# Altium schematic sheet Bite_Force_System_Schematic.SchDoc
size A3; SheetNumber: 1; SheetTotal: 1
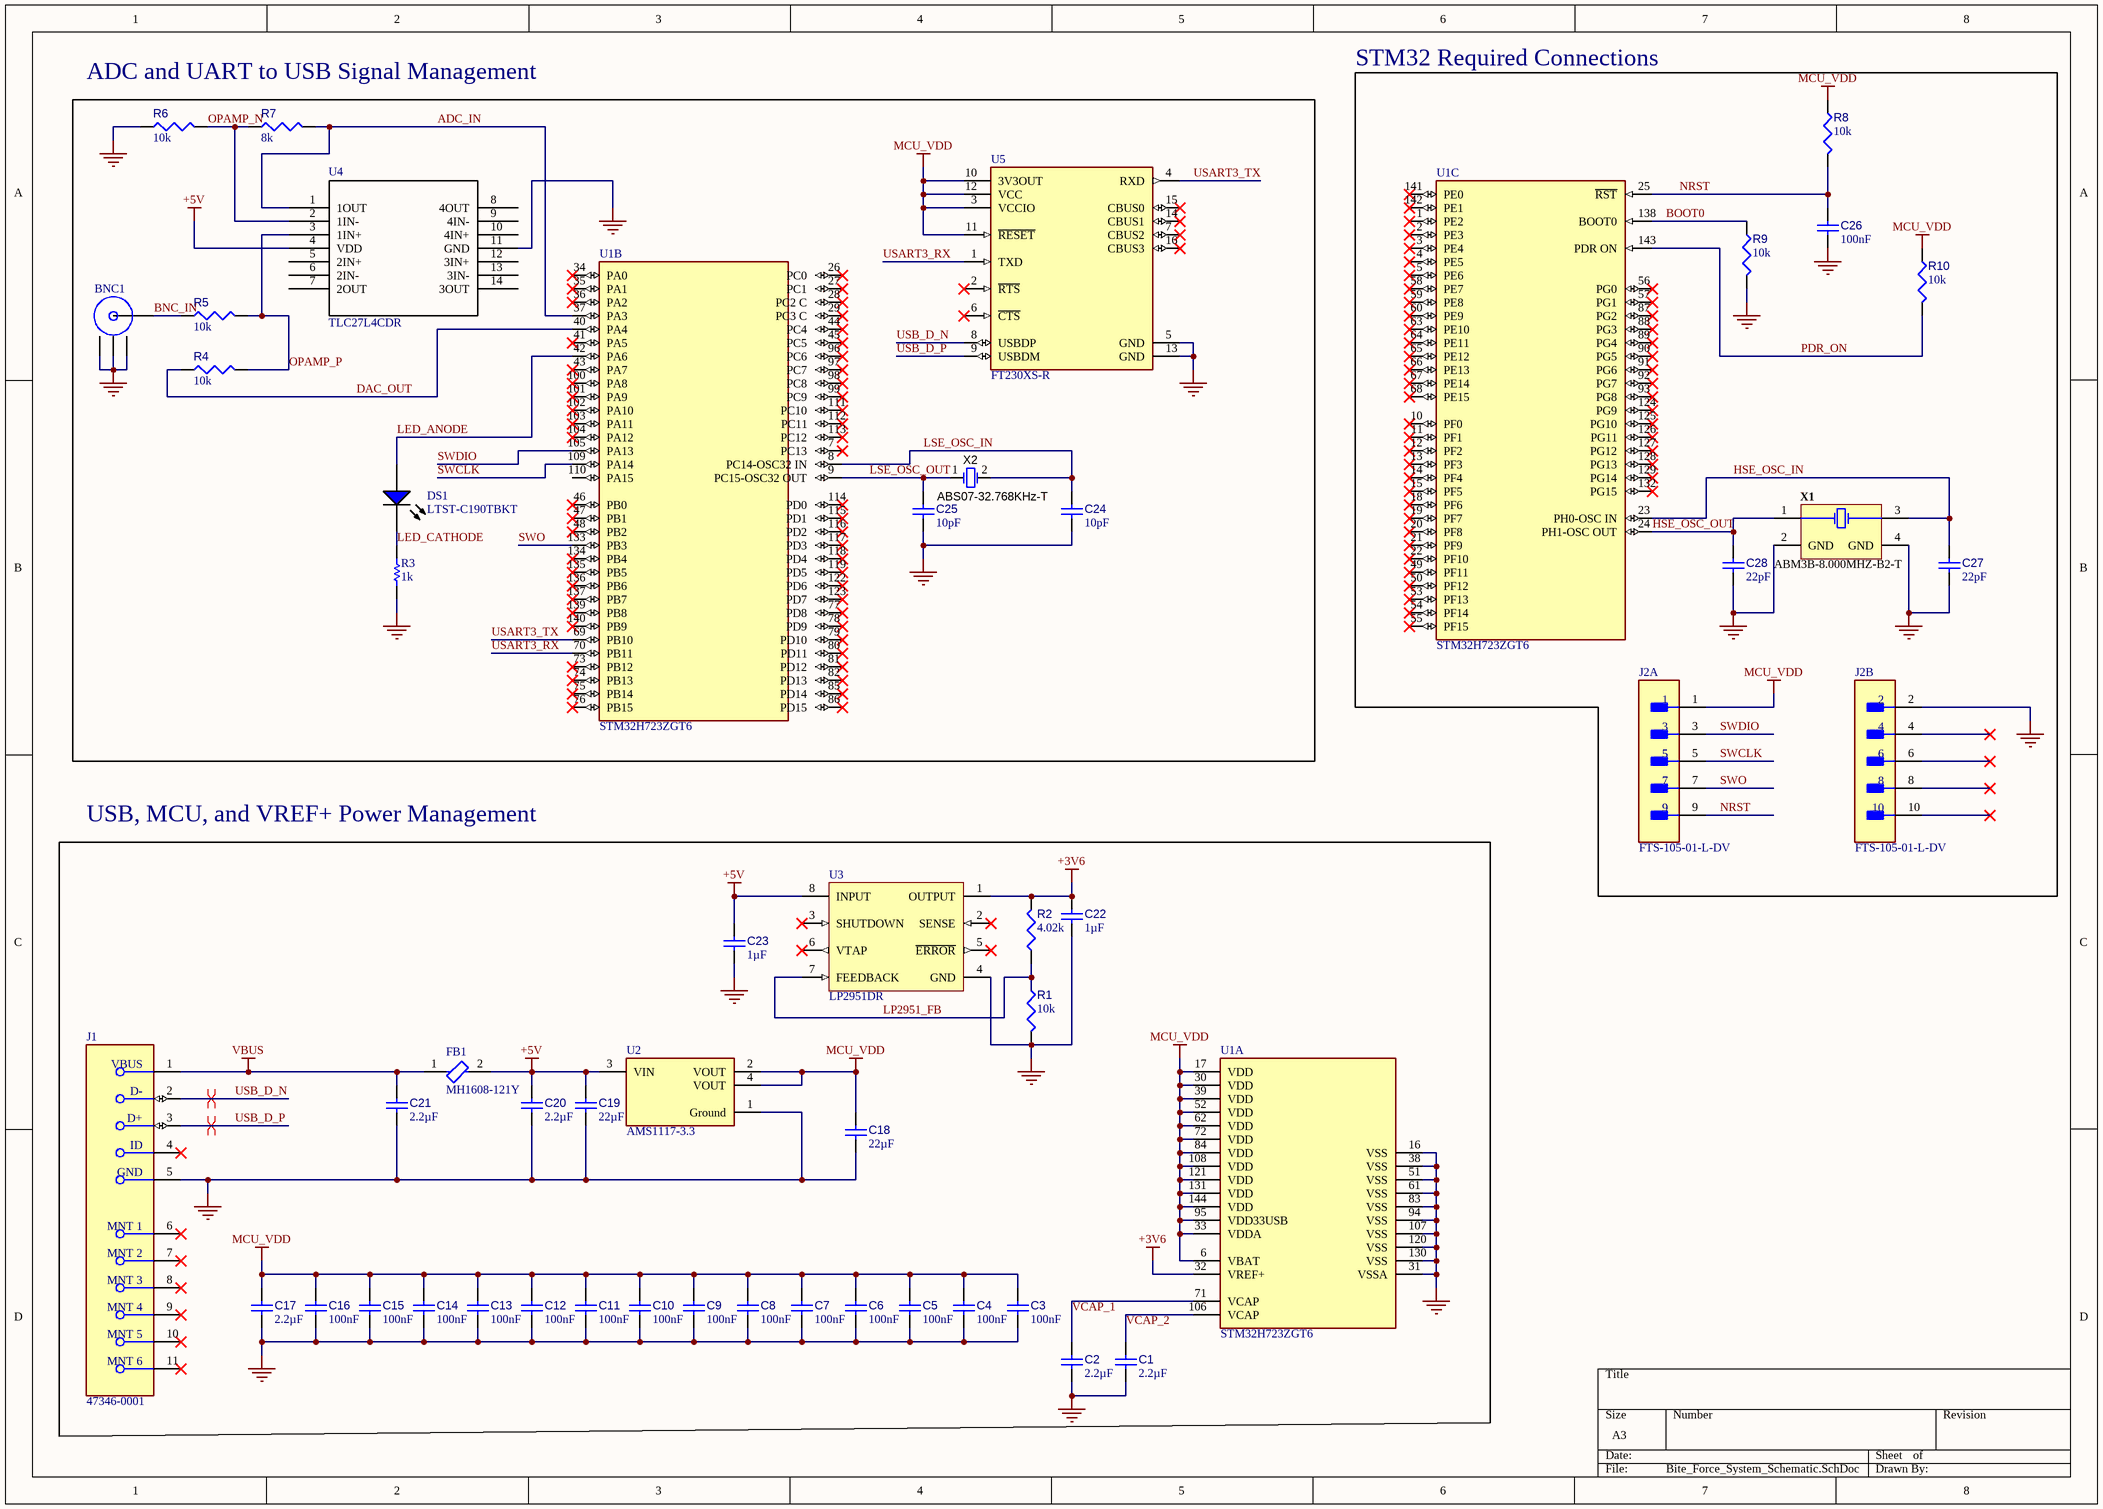
[diagram p0: Bite_Force_System_Schematic.SchDoc]

## Parts
BNC1  KH-BNC75-3511  [KH-BNC75-3511-Footprint-1]  (value not drawn)
C1  value 2.2µF  [CAPC0402(1005)60_L]  (hidden comment: Capacitor 2,2µF +/-20% 10V 0402)
C2  value 2.2µF  [CAPC0402(1005)60_L]  (hidden comment: Capacitor 2,2µF +/-20% 10V 0402)
C3  value 100nF  [CAPC0402(1005)60_L]  (hidden comment: Capacitor 100nF +/-20% 25V 0402)
C4  value 100nF  [CAPC0402(1005)60_L]  (hidden comment: Capacitor 100nF +/-20% 25V 0402)
C5  value 100nF  [CAPC0402(1005)60_L]  (hidden comment: Capacitor 100nF +/-20% 25V 0402)
C6  value 100nF  [CAPC0402(1005)60_L]  (hidden comment: Capacitor 100nF +/-20% 25V 0402)
C7  value 100nF  [CAPC0402(1005)60_L]  (hidden comment: Capacitor 100nF +/-20% 25V 0402)
C8  value 100nF  [CAPC0402(1005)60_L]  (hidden comment: Capacitor 100nF +/-20% 25V 0402)
C9  value 100nF  [CAPC0402(1005)60_L]  (hidden comment: Capacitor 100nF +/-20% 25V 0402)
C10  value 100nF  [CAPC0402(1005)60_L]  (hidden comment: Capacitor 100nF +/-20% 25V 0402)
C11  value 100nF  [CAPC0402(1005)60_L]  (hidden comment: Capacitor 100nF +/-20% 25V 0402)
C12  value 100nF  [CAPC0402(1005)60_L]  (hidden comment: Capacitor 100nF +/-20% 25V 0402)
C13  value 100nF  [CAPC0402(1005)60_L]  (hidden comment: Capacitor 100nF +/-20% 25V 0402)
C14  value 100nF  [CAPC0402(1005)60_L]  (hidden comment: Capacitor 100nF +/-20% 25V 0402)
C15  value 100nF  [CAPC0402(1005)60_L]  (hidden comment: Capacitor 100nF +/-20% 25V 0402)
C16  value 100nF  [CAPC0402(1005)60_L]  (hidden comment: Capacitor 100nF +/-20% 25V 0402)
C17  value 2.2µF  [CAPC0402(1005)60_L]  (hidden comment: Capacitor 2,2µF +/-20% 10V 0402)
C18  value 22µF  [CAPC0805(2012)145_L]  (hidden comment: Capacitor 22µF +/-40% 16V 0805)
C19  value 22µF  [CAPC0805(2012)145_L]  (hidden comment: Capacitor 22µF +/-40% 16V 0805)
C20  value 2.2µF  [CAPC0402(1005)60_L]  (hidden comment: Capacitor 2,2µF +/-20% 10V 0402)
C21  value 2.2µF  [CAPC0402(1005)60_L]  (hidden comment: Capacitor 2,2µF +/-20% 10V 0402)
C22  value 1µF  [CAPC1608X90X35ML15T15]  (hidden comment: Capacitor 1uF +/- 10% 16V 0603)
C23  value 1µF  [CAPC1608X90X35ML15T15]  (hidden comment: Capacitor 1uF +/- 10% 16V 0603)
C24  value 10pF  [CAPC1005X55X25ML05T05]  (hidden comment: Capacitor 10 pF +/- 5% 50 V 0402)
C25  value 10pF  [CAPC1005X55X25ML05T05]  (hidden comment: Capacitor 10 pF +/- 5% 50 V 0402)
C26  value 100nF  [CAPC0402(1005)60_L]  (hidden comment: Capacitor 100nF +/-20% 25V 0402)
C27  value 22pF  [CAPC0402(1005)60_L]  (hidden comment: Capacitor 22pF +/-10% 50V 0402)
C28  value 22pF  [CAPC0402(1005)60_L]  (hidden comment: Capacitor 22pF +/-10% 50V 0402)
DS1  LTST-C190TBKT  [LTST-C190TBKT-2_V]
FB1  MH1608-121Y  [FP-MH1608-MFG]
J1  47346-0001  [FP-473460001-MFG]
J2  FTS-105-01-L-DV  [FP-FTS-105-01-L-DV-MFG]  (parts A,B of 2)
R1  value 10k  [RESC0402(1005)_L]  (hidden comment: Resistor 10K  +/-1 % 0402 63 mW)
R2  value 4.02k  [RESC0402(1005)_L]  (hidden comment: Resistor 4K02 +/-1 % 0402 63 mW)
R3  value 1k  [RESC3116X70X50ML13T20]  (hidden comment: Resistor 1k +/-1% 1206 250 mW)
R4  value 10k  [RESC0402(1005)_L]  (hidden comment: Resistor 10K  +/-1 % 0402 63 mW)
R5  value 10k  [RESC0402(1005)_L]  (hidden comment: Resistor 10K  +/-1 % 0402 63 mW)
R6  value 10k  [RESC0402(1005)_L]  (hidden comment: Resistor 10K  +/-1 % 0402 63 mW)
R7  value 8k  [RT0603BRE078KL-Footprint-1]  (hidden comment: RT0603BRE078KL)
R8  value 10k  [RESC0402(1005)_L]  (hidden comment: Resistor 10K  +/-1 % 0402 63 mW)
R9  value 10k  [RESC0402(1005)_L]  (hidden comment: Resistor 10K  +/-1 % 0402 63 mW)
R10  value 10k  [RESC0402(1005)_L]  (hidden comment: Resistor 10K  +/-1 % 0402 63 mW)
U1  STM32H723ZGT6  [FP-LQFP144-1A-MFG]  (parts A,B,C of 3)
U2  AMS1117-3.3  [FP-AMS1117-IPC_B]
U3  LP2951DR  [D0008A_L]
U4  TLC27L4CDR  [TLC27L4CDR-Footprint-1]
U5  FT230XS-R  [FP-SSOP-16-IPC_C]
X1  ABM3B-8.000MHZ-B2-T  [ABRA-ABM3B_V]
X2  ABS07-32.768KHz-T  [ABRA-ABS07-2_V]

## Blocks framed on the sheet
ADC and UART to USB Signal Management: BNC1 C24 C25 DS1 R3-R7 U1 U4 U5 X2
STM32 Required Connections: C26-C28 J2 R8-R10 U1 X1
USB, MCU, and VREF+ Power Management: C1-C23 FB1 J1 R1 R2 U1-U3

## Nets
+3V6: C22.1 R2.2 U1.32(VREF+) U3.1(OUTPUT)
+5V: C19.1 C20.1 C23.1 FB1.2 U2.3(VIN) U3.8(INPUT) U4.4(VDD)
GND: BNC1.2 BNC1.3 BNC1.4 C1.2 C2.2 C3.2 C4.2 C5.2 C6.2 C7.2 C8.2 C9.2 C10.2 C11.2 C12.2 C13.2 C14.2 C15.2 C16.2 C17.2 C18.2 C19.2 C20.2 C21.2 C22.2 C23.2 C24.2 C25.2 C26.2 C27.1 C28.1 J1.5(GND) J2.2 R1.2 R3.1 R6.1 R9.2 U1.16(VSS) U1.31(VSSA) U1.38(VSS) U1.51(VSS) U1.61(VSS) U1.83(VSS) U1.94(VSS) U1.107(VSS) U1.120(VSS) U1.130(VSS) U2.1(Ground) U3.4(GND) U4.11(GND) U5.5(GND) U5.13(GND) X1.2(GND) X1.4(GND)
MCU_VDD: C3.1 C4.1 C5.1 C6.1 C7.1 C8.1 C9.1 C10.1 C11.1 C12.1 C13.1 C14.1 C15.1 C16.1 C17.1 C18.1 J2.1 R8.1 R10.1 U1.6(VBAT) U1.17(VDD) U1.30(VDD) U1.33(VDDA) U1.39(VDD) U1.52(VDD) U1.62(VDD) U1.72(VDD) U1.84(VDD) U1.95(VDD33USB) U1.108(VDD) U1.121(VDD) U1.131(VDD) U1.144(VDD) U2.2(VOUT) U2.4(VOUT) U5.3(VCCIO) U5.10(3V3OUT) U5.11(~{RESET}) U5.12(VCC)
VBUS: C21.1 FB1.1 J1.1(VBUS)
ADC_IN: R7.2 U1.37(PA3) U4.1(1OUT)
BNC_IN: BNC1.1 R5.1
BOOT0: R9.1 U1.138(BOOT0)
DAC_OUT: R4.1 U1.40(PA4)
HSE_OSC_IN: C27.2 U1.23(PH0-OSC_IN) X1.3(X2)
HSE_OSC_OUT: C28.2 U1.24(PH1-OSC_OUT) X1.1(X1)
LED_ANODE: DS1.1(A) U1.42(PA6)
LED_CATHODE: DS1.2(K) R3.2
LP2951_FB: R1.1 R2.1 U3.7(FEEDBACK)
LSE_OSC_IN: C24.1 U1.8(PC14-OSC32_IN) X2.2(OSC2)
LSE_OSC_OUT: C25.1 U1.9(PC15-OSC32_OUT) X2.1(OSC1)
NRST: C26.1 J2.9 R8.2 U1.25(~{RST})
OPAMP_N: R6.2 R7.1 U4.2(1IN-)
OPAMP_P: R4.2 R5.2 U4.3(1IN+)
PDR_ON: R10.2 U1.143(PDR_ON)
SWCLK: J2.5 U1.109(PA14)
SWDIO: J2.3 U1.105(PA13)
SWO: J2.7 U1.133(PB3)
USART3_RX: U1.70(PB11) U5.1(TXD)
USART3_TX: U1.69(PB10) U5.4(RXD)
USB_D_N: J1.2(D-) U5.8(USBDP)
USB_D_P: J1.3(D+) U5.9(USBDM)
VCAP_1: C2.1 U1.71(VCAP)
VCAP_2: C1.1 U1.106(VCAP)

Not connected (* = marked no-connect by the designer): J1 4(ID)* 6(MNT_1)* 7(MNT_2)* 8(MNT_3)* 9(MNT_4)* 10(MNT_5)* 11(MNT_6)*; J2 4* 6* 8* 10*; U1 1(PE2)* 2(PE3)* 3(PE4)* 4(PE5)* 5(PE6)* 7(PC13)* 10(PF0)* 11(PF1)* 12(PF2)* 13(PF3)* 14(PF4)* 15(PF5)* 18(PF6)* 19(PF7)* 20(PF8)* 21(PF9)* 22(PF10)* 26(PC0)* 27(PC1)* 28(PC2_C)* 29(PC3_C)* 34(PA0)* 35(PA1)* 36(PA2)* 41(PA5)* 43(PA7)* 44(PC4)* 45(PC5)* 46(PB0)* 47(PB1)* 48(PB2)* 49(PF11)* 50(PF12)* 53(PF13)* 54(PF14)* 55(PF15)* 56(PG0)* 57(PG1)* 58(PE7)* 59(PE8)* 60(PE9)* 63(PE10)* 64(PE11)* 65(PE12)* 66(PE13)* 67(PE14)* 68(PE15)* 73(PB12)* 74(PB13)* 75(PB14)* 76(PB15)* 77(PD8)* 78(PD9)* 79(PD10)* 80(PD11)* 81(PD12)* 82(PD13)* 85(PD14)* 86(PD15)* 87(PG2)* 88(PG3)* 89(PG4)* 90(PG5)* 91(PG6)* 92(PG7)* 93(PG8)* 96(PC6)* 97(PC7)* 98(PC8)* 99(PC9)* 100(PA8)* 101(PA9)* 102(PA10)* 103(PA11)* 104(PA12)* 110(PA15) 111(PC10)* 112(PC11)* 113(PC12)* 114(PD0)* 115(PD1)* 116(PD2)* 117(PD3)* 118(PD4)* 119(PD5)* 122(PD6)* 123(PD7)* 124(PG9)* 125(PG10)* 126(PG11)* 127(PG12)* 128(PG13)* 129(PG14)* 132(PG15)* 134(PB4)* 135(PB5)* 136(PB6)* 137(PB7)* 139(PB8)* 140(PB9)* 141(PE0)* 142(PE1)*; U3 2(SENSE)* 3(SHUTDOWN)* 5(~{ERROR})* 6(VTAP)*; U4 5(2IN+) 6(2IN-) 7(2OUT) 8(4OUT) 9(4IN-) 10(4IN+) 12(3IN+) 13(3IN-) 14(3OUT); U5 2(~{RTS})* 6(~{CTS})* 7(CBUS2)* 14(CBUS1)* 15(CBUS0)* 16(CBUS3)*

## Layout directives
differential pair; differential pair class USB: USB_D_N, USB_D_P

## Library data of the parts
BNC1 = CMP-002-00074-2: 1 Inner Hole BNC Board-End Elbow 3GHz -55℃~+155℃ 75Ω 9.5mm Plugin Coaxial Connectors (RF) ROHS
C1 C2 C17 C20 C21 = CMP-001-00056-4: Chip Capacitor, 2,2µF +/-20%, 10V, 0402, Thickness 0.6 mm; Tolerance: 10%; Mounting Technology: SMT; Max Operating Temperature: 85°C; Case/Package: 0402; Pins: 2; Min Operating Temperature: -55°C; Voltage Rating: 10V
C3-C16 C26 = CMP-001-00065-4: Chip Capacitor, 100nF +/-20%, 25V, 0402, Thickness 0.6 mm; Tolerance: 10%; Max Operating Temperature: 85°C; Min Operating Temperature: -55°C; Pins: 2; Voltage Rating: 25V; Mounting Technology: SMT; Case/Package: 0402
C18 C19 = CMP-001-00081-4: Chip Capacitor, 22µF +/-40%, 16V, 0805, Thickness 1.45 mm; Tolerance: 5%; Voltage Rating: 16V; Mounting Technology: SMT; Pins: 2; Max Operating Temperature: 85°C; Case/Package: 0805; Min Operating Temperature: -55°C
C22 C23 = CMP-001-00004-6: Chip Capacitor, 1 uF, +/- 10%, 16 V, 0603 (1608 Metric); Capacitor Type: Ceramic; Mounting Technology: SM; RoHS Compliant: True; Min Operating Temperature: -55°C; Case/Package: 0603; Pins: 2; Voltage Rating: 16V; Max Operating Temperature: 125°C; Tolerance: 10%
C24 C25 = CMP-001-00013-6: Chip Capacitor, 10 pF, +/- 5%, 50 V, 0402 (1005 Metric); Capacitor Type: Ceramic; Voltage Rating: 50V; Max Operating Temperature: 125°C; Pins: 2; Mounting Technology: SM; Tolerance: 5%; RoHS Compliant: True; Case/Package: 0402; Min Operating Temperature: -55°C
C27 C28 = CMP-001-00073-3: Chip Capacitor, 22pF +/-10%, 50V, 0402, Thickness 0.6 mm; Tolerance: 10%; Pins: 2; Voltage Rating: 50V; Max Operating Temperature: 85°C; Min Operating Temperature: -55°C; Mounting Technology: SMT; Case/Package: 0402
DS1 = CMP-007-00026-2: LED Uni-Color Blue, 76 mW, 20 mA, -20 to 80 degC, 2-Pin SMD, RoHS, Tape and Reel; Manufacturer: Lite-On; Forward Voltage: 2.8V; Lens Style: Diffused; Luminous Intensity: 28mcd; Forward Current: 20mA; Viewing Angle: 130degrees; Nominal Vf: 3.3V; Packaging: TapeandReel; Min Operating Temperature: -20°C; Illumination Colour: Blue; Package Quantity: 3000; Pins: 2; Mounting Technology: SM; Package Reference: C190TBKT-2; Package Description: 2-Pin Surface Mount Device, Body 1.6 x 0.8 mm; RoHS Compliant: True; Datasheet URL: http://optoelectronics.liteon.com/upload/download/DS-22-99-0224/S_110_LTST-C190TBKT(0630).pdf; Datasheet Version: Rev. K, 08/2011; Manufacturer URL: http://www.us.liteon.com/; Colour: Blue; Case/Package: 0603; Max Operating Temperature: 80°C
FB1 = CMP-00030-00001-1: Ferrite Chip, 1 Function(s), 2A, 2 Pin(s); Mounting Technology: Surface Mount; Min Operating Temperature: -55°C; Max Operating Temperature: 125°C; RoHS Compliant: Yes
J1 = CMP-002-00072-1: USB Connector, 5 Contact(s), Female, Right Angle, Surface Mount Terminal, Locking, Receptacle; Connector Type: TELECOM AND DATACOM CONNECTOR; RoHS Compliant: Yes; Mounting Technology: Cable
J2 = CMP-002-00076-1: Board Connector, 10 Contact(s), 2 Row(s), Male, Straight, 0.05 inch Pitch, Surface Mount Terminal, Locking, Black Insulator; Connector Type: BOARD CONNECTOR; Mounting Technology: Board; Min Operating Temperature: -55°C; Max Operating Temperature: 125°C; RoHS Compliant: Yes
R1 R4-R6 R8-R10 = CMP-009-00149-3: Chip Resistor, 10 kOhms, +/-1 %, 63 mW, -55 to 125 degC, 0402; Power: 63mW; Tolerance: 1%; Min Operating Temperature: -55°C; Case/Package: 0402; Max Operating Temperature: 155°C; Pins: 2
R2 = CMP-009-00153-3: Chip Resistor, 4,02 kOhms, +/-1 %, 63 mW, -55 to 155 degC, 0402; Power: 63mW; Tolerance: 1%; Min Operating Temperature: -55°C; Pins: 2; Case/Package: 0402; Max Operating Temperature: 155°C
R3 = CMP-009-00011-5: Chip Resistor, 1 KOhm, +/- 1%, 0.25 W, -55 to 155 degC, 1206 (3216 Metric); Voltage Rating: 200V; Power: 250mW; Max Operating Temperature: 155°C; Mounting Technology: SM; Tolerance: 1%; Case/Package: 1206; RoHS Compliant: True; Min Operating Temperature: -55°C; Pins: 2
R7 = CMP-009-00182-2: Fixed Resistor; Tolerance: 0.1%; Power: 100mW; Pins: 2; Min Operating Temperature: -55°C; Case/Package: 0603; Mounting Technology: Surface Mount; RoHS Compliant: Yes; Max Operating Temperature: 155°C
U1 = CMP-020-00024-1: RISC Microcontroller, 32-Bit, FLASH, CORTEX-M7 CPU, 550MHz, CMOS, PQFP144
U2 = CMP-019-00049-1: Fixed Positive LDO Regulator, 3.3V, 1.3V Dropout, PDSO3; Case/Package: SOP; Pins: 3; RoHS Compliant: Yes
U3 = CMP-019-00050-1: Adjustable Positive LDO Regulator, 1.235V Min, 30V Max, 0.6V Dropout, BIPolar, PDSO8; Case/Package: SOP; RoHS Compliant: Yes; Pins: 8
U4 = CMP-014-00003-3: Operational Amplifier, 4 Func, 12000uV Offset-Max, CMOS, PDSO14; Nominal Supply Voltage: 10V; Channels: 4; RoHS Compliant: Yes; Pins: 14; Max Operating Temperature: 70°C; Case/Package: SOP; Min Operating Temperature: 0°C
U5 = CMP-015-00008-1: Microprocessor Circuit, CMOS, PDSO16; Min Supply Voltage: 2.97V; Nominal Supply Voltage: 5V; Max Supply Voltage: 5.5V; Pins: 16; Case/Package: SSOP; RoHS Compliant: Yes; Min Operating Temperature: -40°C; Max Operating Temperature: 85°C
X1 = CMP-003-00021-2: Ceramic SMD Crystal, 8 MHz, +/- 20 ppm, 18 pF, -20 to 70 degC, 4-Pin SMD, RoHS, Tape and Reel; Manufacturer: Abracon; Resistance: 200Ohm; ESR: 200; Tolerance: 20ppm; Frequency: 8MHz; Load Capacitance: 18pF; Mounting Technology: SM; Case/Package: CSMD; Pins: 4; Datasheet Version: Aug-15; Datasheet URL: http://www.abracon.com/Resonators/abm3b.pdf; Manufacturer URL: http://www.abracon.com/; Package Quantity: 1000; Package Description: 4-Pin Surface Mount Device, Body 5 x 3.2 mm; Package Reference: ABM3B; Min Operating Temperature: -20°C; Max Operating Temperature: 70°C; Packaging: TapeandReel; Frequency Tolerance: 20ppm; RoHS Compliant: True
X2 = CMP-003-00022-2: Low Profile Crystal, 32.768 kHz, +/- 20 ppm, 12.5 pF, -40 to 85 degC, 2-Pin SMD, Pb-Free, Tape and Reel; Manufacturer: Abracon; Frequency Tolerance: 20ppm; ESR: 70k; Load Capacitance: 12.5pF; Max Operating Temperature: 85°C; Mounting Technology: SM; Manufacturer URL: http://www.abracon.com/; Pins: 2; Packaging: TapeandReel; Tolerance: 20ppm; Min Operating Temperature: -40°C; Frequency: 32.768kHz; Datasheet URL: http://www.abracon.com/Resonators/ABS07.pdf; RoHS Compliant: True; Package Description: 2-Pin Surface Mount Device, Body 3.2 x 1.5 mm; Datasheet Version: Aug-15; Package Reference: ABS07-2; Package URL: http://www.abracon.com/Support/PackageDrawing/Resonators/ABS07.PDF; Package Quantity: 3000; Case/Package: CSMD